# EAGLE design untitled (EAGLE 5.11)
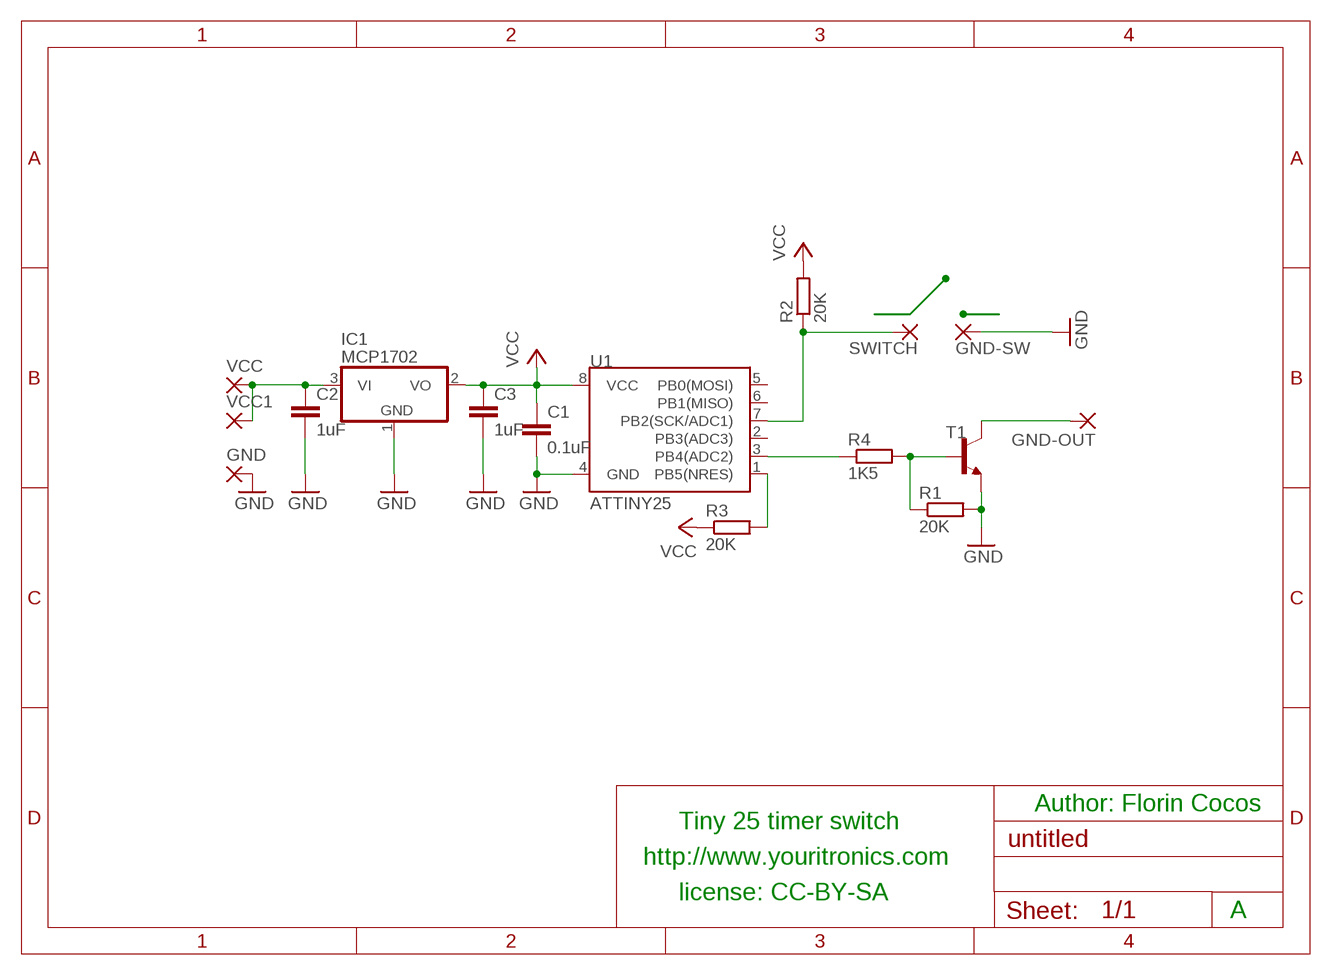
[diagram p0: schematic, sheet 1]

## Parts
C1  0.1uF  C-EUC0603  [C0603]
C2  1uF  C-EUC0603  [C0603]
C3  1uF  C-EUC0603  [C0603]
GND  SMD2  [SMD1,27-2,54]
GND-OUT  SMD2  [SMD1,27-2,54]
GND-SW  SMD2  [SMD1,27-2,54]
IC1  MCP1702  MCP1703CB  [SOT23]
R1  20K  R-EU_R0603  [R0603]
R2  20K  R-EU_R0603  [R0603]
R3  20K  R-EU_R0603  [R0603]
R4  1K5  R-EU_R0603  [R0603]
SWITCH  SMD2  [SMD1,27-2,54]
T1  MMBTA42LT1-NPN-SOT23-BEC  [SOT23-BEC]
U1  ATTINY25  ATTINY45  [SO08-EIAJ]
VCC  SMD2  [SMD1,27-2,54]
VCC1  SMD2  [SMD1,27-2,54]

## Nets
GND: C1.2 C2.2 C3.2 GND-SW.1(P) GND.1(P) IC1.1(GND) R1.2 T1.E U1.4(GND)
N$1: R2.1 SWITCH.1(P) U1.7(PB2(SCK/ADC1))
N$2: R1.1 R4.2 T1.B
N$3: R4.1 U1.3(PB4(ADC2))
N$4: GND-OUT.1(P) T1.C
N$5: R3.2 U1.1(PB5(NRES))
N$6: C2.1 IC1.3(VI) VCC1.1(P) VCC.1(P)
VCC: C1.1 C3.1 IC1.2(VO) R2.2 R3.1 U1.8(VCC)
Unconnected: U1.2(PB3(ADC3)) U1.5(PB0(MOSI)) U1.6(PB1(MISO))

## Notes on the sheet
- Author: Florin Cocos
- Tiny 25 timer switch
- http://www.youritronics.com
- license: CC-BY-SA
- A

## Library data of the parts
C1-C3 = rcl:C-EU: CAPACITOR, European symbol
GND GND-OUT GND-SW SWITCH VCC VCC1 = wirepad:SMD2: SMD PAD
IC1 = linear:MCP1703: 250 mA, 16V, Low Quiescent Current LDO Regulator Source: http://ww1.microchip.com/downloads/en/DeviceDoc/22049b.pdf
R1-R4 = resistor:R-EU_: RESISTOR, European symbol
T1 = transistor:*-NPN-: NPN Transistror BF959 corrected 2008.03.06
U1 = SparkFun:ATTINY45: Atmel ATTiny45

## Board
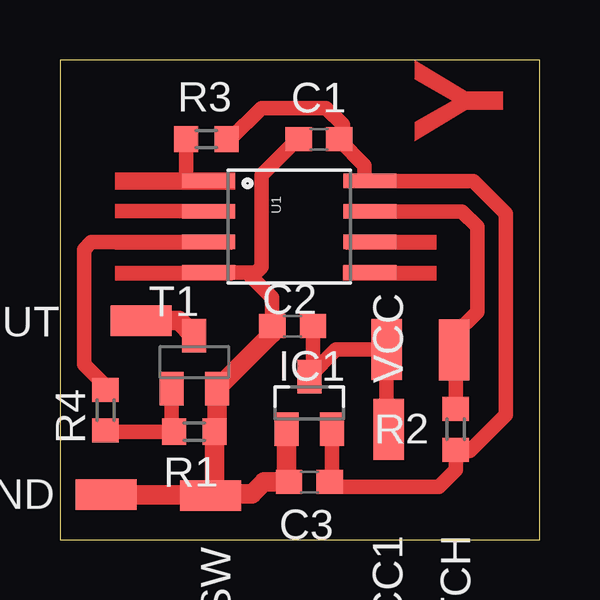
[diagram p1: board, top side]

Size 20 x 20 mm. Coordinates in mm from the lower left corner, seen from the top.
Outline: 0,0 20,0 20,20 0,20 0,0
Copper layers (1*16): Top 0.035mm / dielectric 1.5mm / Bottom 0.035mm
Design rules "default": minimum track width 10mil, minimum drill 24mil, track to track 8mil, track to pad 8mil, pad to pad 8mil, via to via 8mil, smd to smd 8mil, copper to edge 40mil, drill to drill 8mil, minimum pad ring 10mil, minimum via ring 8mil, stop-mask expansion 4mil, vias tented up to drill 0mil, thermal gap 10mil

### Footprints (pad centres in the part's own frame; a part is rotated, then mirrored left to right if it is on the bottom)
C0603 = smd 1.1 x 1: 1 -0.85,0; 2 0.85,0
SMD1,27-2,54 = smd 1.27 x 2.54: 1 0,0
SOT23 = smd 1 x 1.4: 1 -0.95,-1.1; 2 0.95,-1.1; 3 0,1.1
R0603 = smd 1 x 1.1: 1 -0.85,0; 2 0.85,0
SOT23-BEC = smd 1 x 1.4: B -0.95,-1.1; C 0,1.1; E 0.95,-1.1
SO08-EIAJ = smd 0.61 x 2.21: 1 -1.905,-3.378; 2 -0.635,-3.378; 3 0.635,-3.378; 4 1.905,-3.378; 5 1.905,3.353; 6 0.635,3.353; 7 -0.635,3.353; 8 -1.905,3.353

### Placement (x,y rotation side)
C1  10.8,16.7 180 top
C2  9.7,8.9 180 top
C3  10.4,2.4 180 top
GND  1.92,1.87 270 top
GND-OUT  3.39,9.13 90 top
GND-SW  6.29,1.84 90 top
IC1  10.4,5.7 0 top
R1  5.6,4.5 0 top
R2  16.5,4.6 270 top
R3  6.1,16.7 180 top
R4  1.9,5.4 270 top
SWITCH  16.43,7.91 0 top
T1  5.6,7.4 0 top
U1  9.58,13.05 270 top
VCC  13.62,7.92 0 top
VCC1  13.7,4.6 0 top

### Tracks (layer width: path | path; a pad name or v marks a point on that pad's centre or on a via)
GND
  Top 0.61: 7.8,11.14 U1.4 | 7.8,11.14 8.18,11.14 8.4,11.37 8.4,15.2 9.9,16.7 C1.2 | C2.2 8.85,10.1 7.8,11.14
  Top 0.813: GND-SW.1 6.45,2 R1.2 6.55,4.6 T1.E 8.85,8.6 C2.2 | GND.1 6.26,1.87 GND-SW.1 | GND-SW.1 6.35,1.9 8,1.9 8.5,2.4 C3.2 9.45,2.5 IC1.1
N$1
  Top 0.61: R2.1 16.5,7.84 SWITCH.1 16.43,8.53 17.4,9.5 17.4,13.05 16.77,13.69 U1.7
N$2
  Top 0.61: T1.B 4.65,4.6 R1.1 1.95,4.5 R4.2
N$3
  Top 0.61: R4.1 1.9,6.4 1,7.3 1,12.1 1.3,12.4 6.19,12.4 U1.3
N$4
  Top 0.813: GND-OUT.1 4.97,9.13 T1.C
N$5
  Top 0.61: R3.2 5.25,14.95 5.3,14.9 5.36,14.96 U1.1
N$6
  Top 0.61: C2.1 10.55,6.95 IC1.3 11.52,7.92 VCC.1 13.62,4.68 VCC1.1
VCC
  Top 0.61: R3.1 7.1,16.7 8.4,18 11.1,18 11.8,17.3 11.8,16.85 C1.1 11.65,16.65 12.7,15.6 12.7,15.19 U1.8 17.25,14.96 18.6,13.6 18.6,5.2 17.1,3.7 16.55,3.7 R2.2 16.5,2.9 15.8,2.2 11.45,2.2 C3.1 11.35,2.5 IC1.2
(copper drawn outside any net)
  shapes: Top area x6

### Text on the board
Top: Y
Document: http://www.youritronics.com | license: CC-BY-SA